# Altium schematic sheet Mcu_Control_Interface.SchDoc
size A4
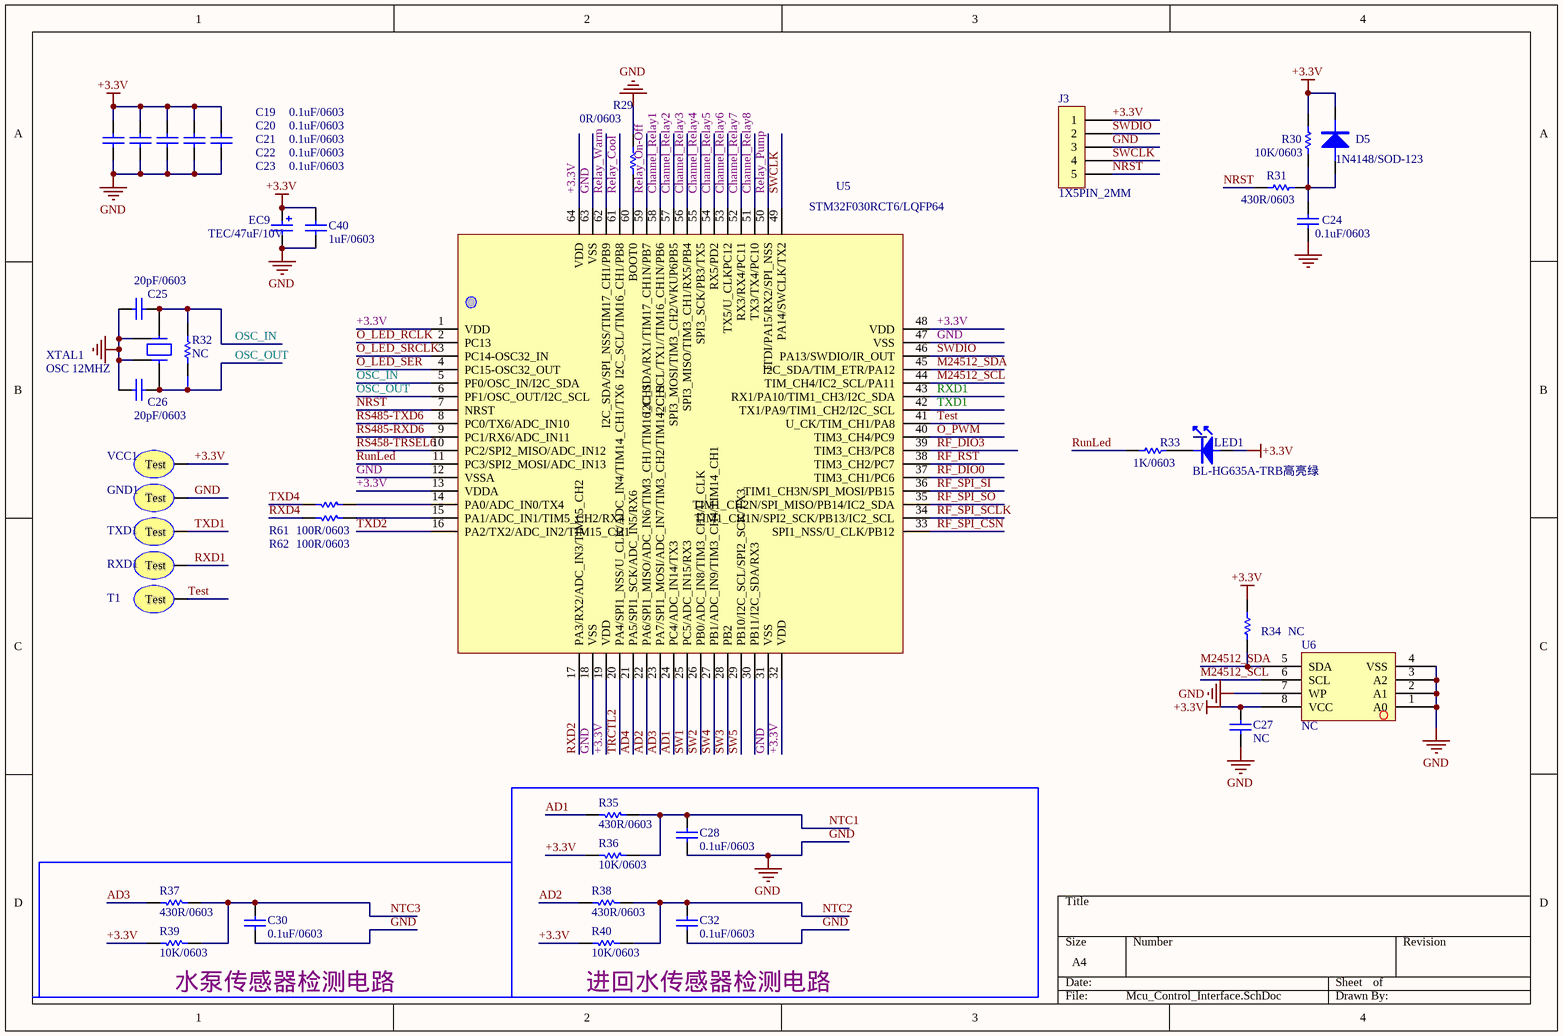
[diagram p0: Mcu_Control_Interface.SchDoc]

## Parts
C19  0.1uF/0603  [CAP/SMT/0603C]
C20  0.1uF/0603  [CAP/SMT/0603C]
C21  0.1uF/0603  [CAP/SMT/0603C]
C22  0.1uF/0603  [CAP/SMT/0603C]
C23  0.1uF/0603  [CAP/SMT/0603C]
C24  0.1uF/0603  [CAP/SMT/0603C]
C25  20pF/0603  [CAP/SMT/0603C]
C26  20pF/0603  [CAP/SMT/0603C]
C27  NC  [CAP/SMT/0603C]
C28  0.1uF/0603  [CAP/SMT/0603C]
C30  0.1uF/0603  [CAP/SMT/0603C]
C32  0.1uF/0603  [CAP/SMT/0603C]
C40  1uF/0603  [CAP/SMT/0603C]
D5  1N4148/SOD-123  [D/SMT/SOD-123]
EC9  TEC/47uF/10V  [CAP/SMT/TAJC476M010RNJ]
GND1  OTHER/TEST  [TEST]  (value not drawn)
J3  1X5PIN_2MM  [CON/DIP/1×5PIN/2.0MM]
LED1  BL-HG635A-TRB高亮绿  [D/SMT/LED/0805]
R29  0R/0603  [0603R]
R30  10K/0603  [0603R]
R31  430R/0603  [0603R]
R32  NC  [0603R]
R33  1K/0603  [0603R]
R34  NC  [0603R]
R35  430R/0603  [0603R]
R36  10K/0603  [0603R]
R37  430R/0603  [0603R]
R38  430R/0603  [0603R]
R39  10K/0603  [0603R]
R40  10K/0603  [0603R]
R61  100R/0603  [0603R]
R62  100R/0603  [0603R]
RXD1  OTHER/TEST  [TEST]  (value not drawn)
T1  OTHER/TEST  [TEST]  (value not drawn)
TXD1  OTHER/TEST  [TEST]  (value not drawn)
U5  STM32F030RCT6/LQFP64  [LQFP64]
U6  NC  [SOP-8]
VCC1  OTHER/TEST  [TEST]  (value not drawn)
XTAL1  OSC 12MHZ  [OSC/SMT/12M]

## Nets
+3.3V: C19.2 C20.2 C21.2 C22.2 C23.2 C27.2 C40.2 D5.1(K) EC9.1 J3.1 LED1.2(A) R30.2 R34.1 R36.1 R39.1 R40.1 U5.1(VDD) U5.13(VDDA) U5.19(VDD) U5.32(VDD) U5.48(VDD) U5.64(VDD) U6.8(VCC) VCC1.1(Test)
GND: C19.1 C20.1 C21.1 C22.1 C23.1 C24.1 C25.2 C26.2 C27.1 C28.1 C30.1 C32.1 C40.1 EC9.2 GND1.1(Test) J3.3 R29.2 U5.12(VSSA) U5.18(VSS) U5.31(VSS) U5.47(VSS) U5.63(VSS) U6.1(A0) U6.2(A1) U6.3(A2) U6.4(VSS) U6.7(WP) XTAL1.2 XTAL1.4
AD1: R35.1 U5.24(PC4/ADC_IN14/TX3)
AD2: R38.1 U5.22(PA6/SPI1_MISO/ADC_IN6/TIM3_CH1/TIM16_CH1)
AD3: R37.1 U5.23(PA7/SPI1_MOSI/ADC_IN7/TIM3_CH2/TIM14_CH1)
AD4: U5.21(PA5/SPI1_SCK/ADC_IN5/RX6)
Channel_Relay1: U5.58(I2C_SCL/TX1//TIM16_CH1N/PB6)
Channel_Relay2: U5.57(SPI3_MOSI/TIM3_CH2/WKUP6PB5)
Channel_Relay3: U5.56(SPI3_MISO/TIM3_CH1/RX5/PB4)
Channel_Relay4: U5.55(SPI3_SCK/PB3/TX5)
Channel_Relay5: U5.54(RX5/PD2)
Channel_Relay6: U5.53(TX5/U_CLKPC12)
Channel_Relay7: U5.52(RX3/RX4/PC11)
Channel_Relay8: U5.51(TX3/TX4/PC10)
M24512_SCL: U5.44(TIM_CH4/IC2_SCL/PA11) U6.6(SCL)
M24512_SDA: R34.2 U5.45(I2C_SDA/TIM_ETR/PA12) U6.5(SDA)
NRST: J3.5 R31.1 U5.7(NRST)
NTC1: C28.2 R35.2 R36.2
NTC2: C32.2 R38.2 R40.2
NTC3: C30.2 R37.2 R39.2
O_LED_RCLK: U5.2(PC13)
O_LED_SER: U5.4(PC15-OSC32_OUT)
O_LED_SRCLK: U5.3(PC14-OSC32_IN)
O_PWM: U5.40(TIM3_CH4/PC9)
OSC_IN: C25.1 R32.2 U5.5(PF0/OSC_IN/I2C_SDA) XTAL1.3
OSC_OUT: C26.1 R32.1 U5.6(PF1/OSC_OUT/I2C_SCL) XTAL1.1
Relay_Cool: U5.61(I2C_SCL/TIM16_CH1/PB8)
Relay_On-Off: U5.59(I2C_SDA/RX1/TIM17_CH1N/PB7)
Relay_Pump: U5.50(JTDI/PA15/RX2/SPI_NSS)
Relay_Warm: U5.62(I2C_SDA/SPI_NSS/TIM17_CH1/PB9)
RF_DIO0: U5.37(TIM3_CH1/PC6)
RF_DIO3: U5.39(TIM3_CH3/PC8)
RF_RST: U5.38(TIM3_CH2/PC7)
RF_SPI_CSN: U5.33(SPI1_NSS/U_CLK/PB12)
RF_SPI_SCLK: U5.34(TIM1_CH1N/SPI2_SCK/PB13/IC2_SCL)
RF_SPI_SI: U5.36(TIM1_CH3N/SPI_MOSI/PB15)
RF_SPI_SO: U5.35(TIM1_CH2N/SPI_MISO/PB14/IC2_SDA)
RS458-TRSEL6: U5.10(PC2/SPI2_MISO/ADC_IN12)
RS485-RXD6: U5.9(PC1/RX6/ADC_IN11)
RS485-TXD6: U5.8(PC0/TX6/ADC_IN10)
RunLed: R33.1 U5.11(PC3/SPI2_MOSI/ADC_IN13)
RXD1: RXD1.1(Test) U5.43(RX1/PA10/TIM1_CH3/I2C_SDA)
RXD2: U5.17(PA3/RX2/ADC_IN3/TIM15_CH2)
RXD4: R62.2
SW1: U5.25(PC5/ADC_IN15/RX3)
SW2: U5.26(PB0/ADC_IN8/TIM3_CH3/U_CLK)
SW3: U5.28(PB2)
SW4: U5.27(PB1/ADC_IN9/TIM3_CH4/TIM14_CH1)
SW5: U5.29(PB10/I2C_SCL/SPI2_SCK/TX3)
SWCLK: J3.4 U5.49(PA14/SWCLK/TX2)
SWDIO: J3.2 U5.46(PA13/SWDIO/IR_OUT)
Test: T1.1(Test) U5.41(U_CK/TIM_CH1/PA8)
TRCTL2: U5.20(PA4/SPI1_NSS/U_CLK/ADC_IN4/TIM14_CH1/TX6)
TXD1: TXD1.1(Test) U5.42(TX1/PA9/TIM1_CH2/I2C_SCL)
TXD2: U5.16(PA2/TX2/ADC_IN2/TIM15_CH1)
TXD4: R61.2
NetC24_2: C24.2 D5.2(A) R30.1 R31.2
NetLED1_1: LED1.1(K) R33.2
NetR29_1: R29.1 U5.60(BOOT0)
NetR61_1: R61.1 U5.14(PA0/ADC_IN0/TX4)
NetR62_1: R62.1 U5.15(PA1/ADC_IN1/TIM5_CH2/RX4)

Not connected (* = marked no-connect by the designer): U5 30(PB11/I2C_SDA/RX3)

## Notes on the sheet
- Labels drawn without touching a wire or pin: 水泵传感器检测电路, 进回水传感器检测电路

## Library data of the parts
C19-C28 C30 C32 C40 = CAP/CAP/SMT/0603C
D5 = D/D/SMT/1N4148/SOD-123: VR=75V T(-65-175)P(0.5W)VF=0.6V
EC9 = CAP/TEC/SMT/TAJC476M010RNJ
J3 = CON/DIP/1X5PIN_2MM: Connector
LED1 = D/LED/SMT/BL-HG635A-TRB高亮绿/0805
R29-R40 = RES/RES/SMT/0603
R61 R62 = Res1: Resistor; Manufacturer: Generic Components; Class: Passive; Value: 1K; Published: 08/06/2000; Publisher: Altium Hobart Technology Centre; SubClass: Resistor
U5 = MCU/SMT/STM32F030RCT6/LQFP64
U6 = IC/FLASH/SMT/M24512-RMN6TP/SO8: 512 Kbit serial I2C bus EEPROM with three Chip Enable lines
XTAL1 = XTAL/SMT/OSC12MHZ-2